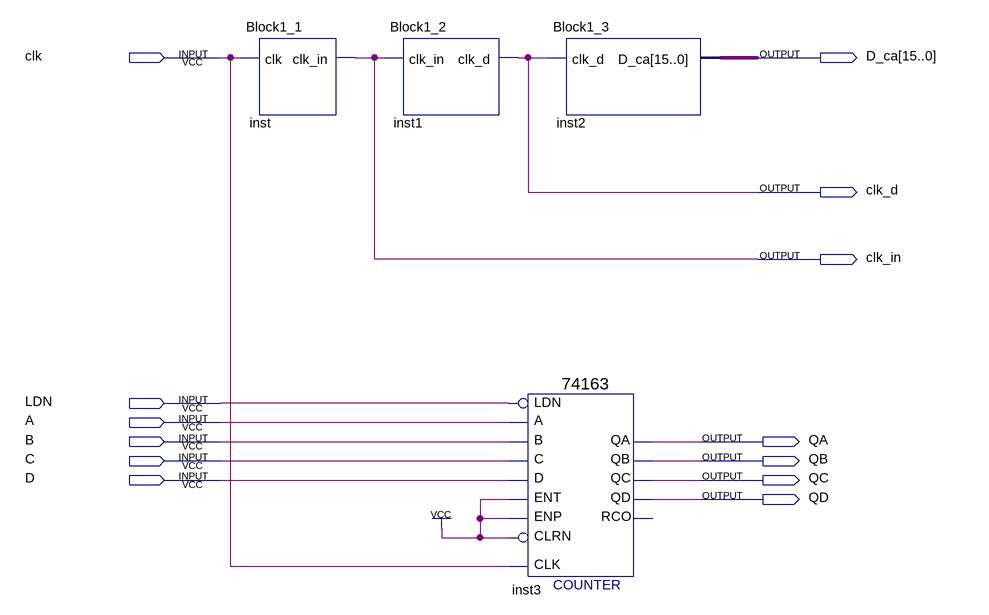
[diagram p0: schematic sheet]
// Quartus schematic Block1_4.bdf as structural Verilog: 4 symbols, 13 pins
module Block1_4 (
  input  clk,
  input  LDN,
  input  A,
  input  B,
  input  C,
  input  D,
  output [15:0] D_ca,
  output clk_d,
  output clk_in,
  output QA,
  output QB,
  output QC,
  output QD
);

  Block1_1 inst (.clk(clk), .clk_in(clk_in));
  Block1_2 inst1 (.clk_in(clk_in), .clk_d(clk_d));
  \74163  inst3 (
    .C(C), .B(B), .A(A), .ENT(1'b1), .D(D), .CLRN(1'b1), .CLK(clk), .ENP(1'b1), .LDN(LDN), .QA(QA), .QB(QB),
    .QC(QC), .QD(QD));  // open: RCO
  Block1_3 inst2 (.clk_d(clk_d), .D_ca(D_ca));
endmodule
